# Altium schematic sheet 06 - Soft_DPHY.SchDoc: Soft DPHY
size A3; Date:: 0; Page Number: 6; Page Size: B; Page Count: 12; Board Rev: B; Project Name: CrossLink-NX Evaluation Board; RevCode: 1.0; Doc: 305-PD-19-0819; DsnPath: C:\Users\HAltinkilit\Downloads\Crosslink-NX-Design-Files\CrossLink-NX-Eval-Brd-Schematic-RevB-191122.DSN; SchematicName: SCHEMATIC1; PageName: 10 - FMC-LPC; PageSize: B; TopSchematic: True
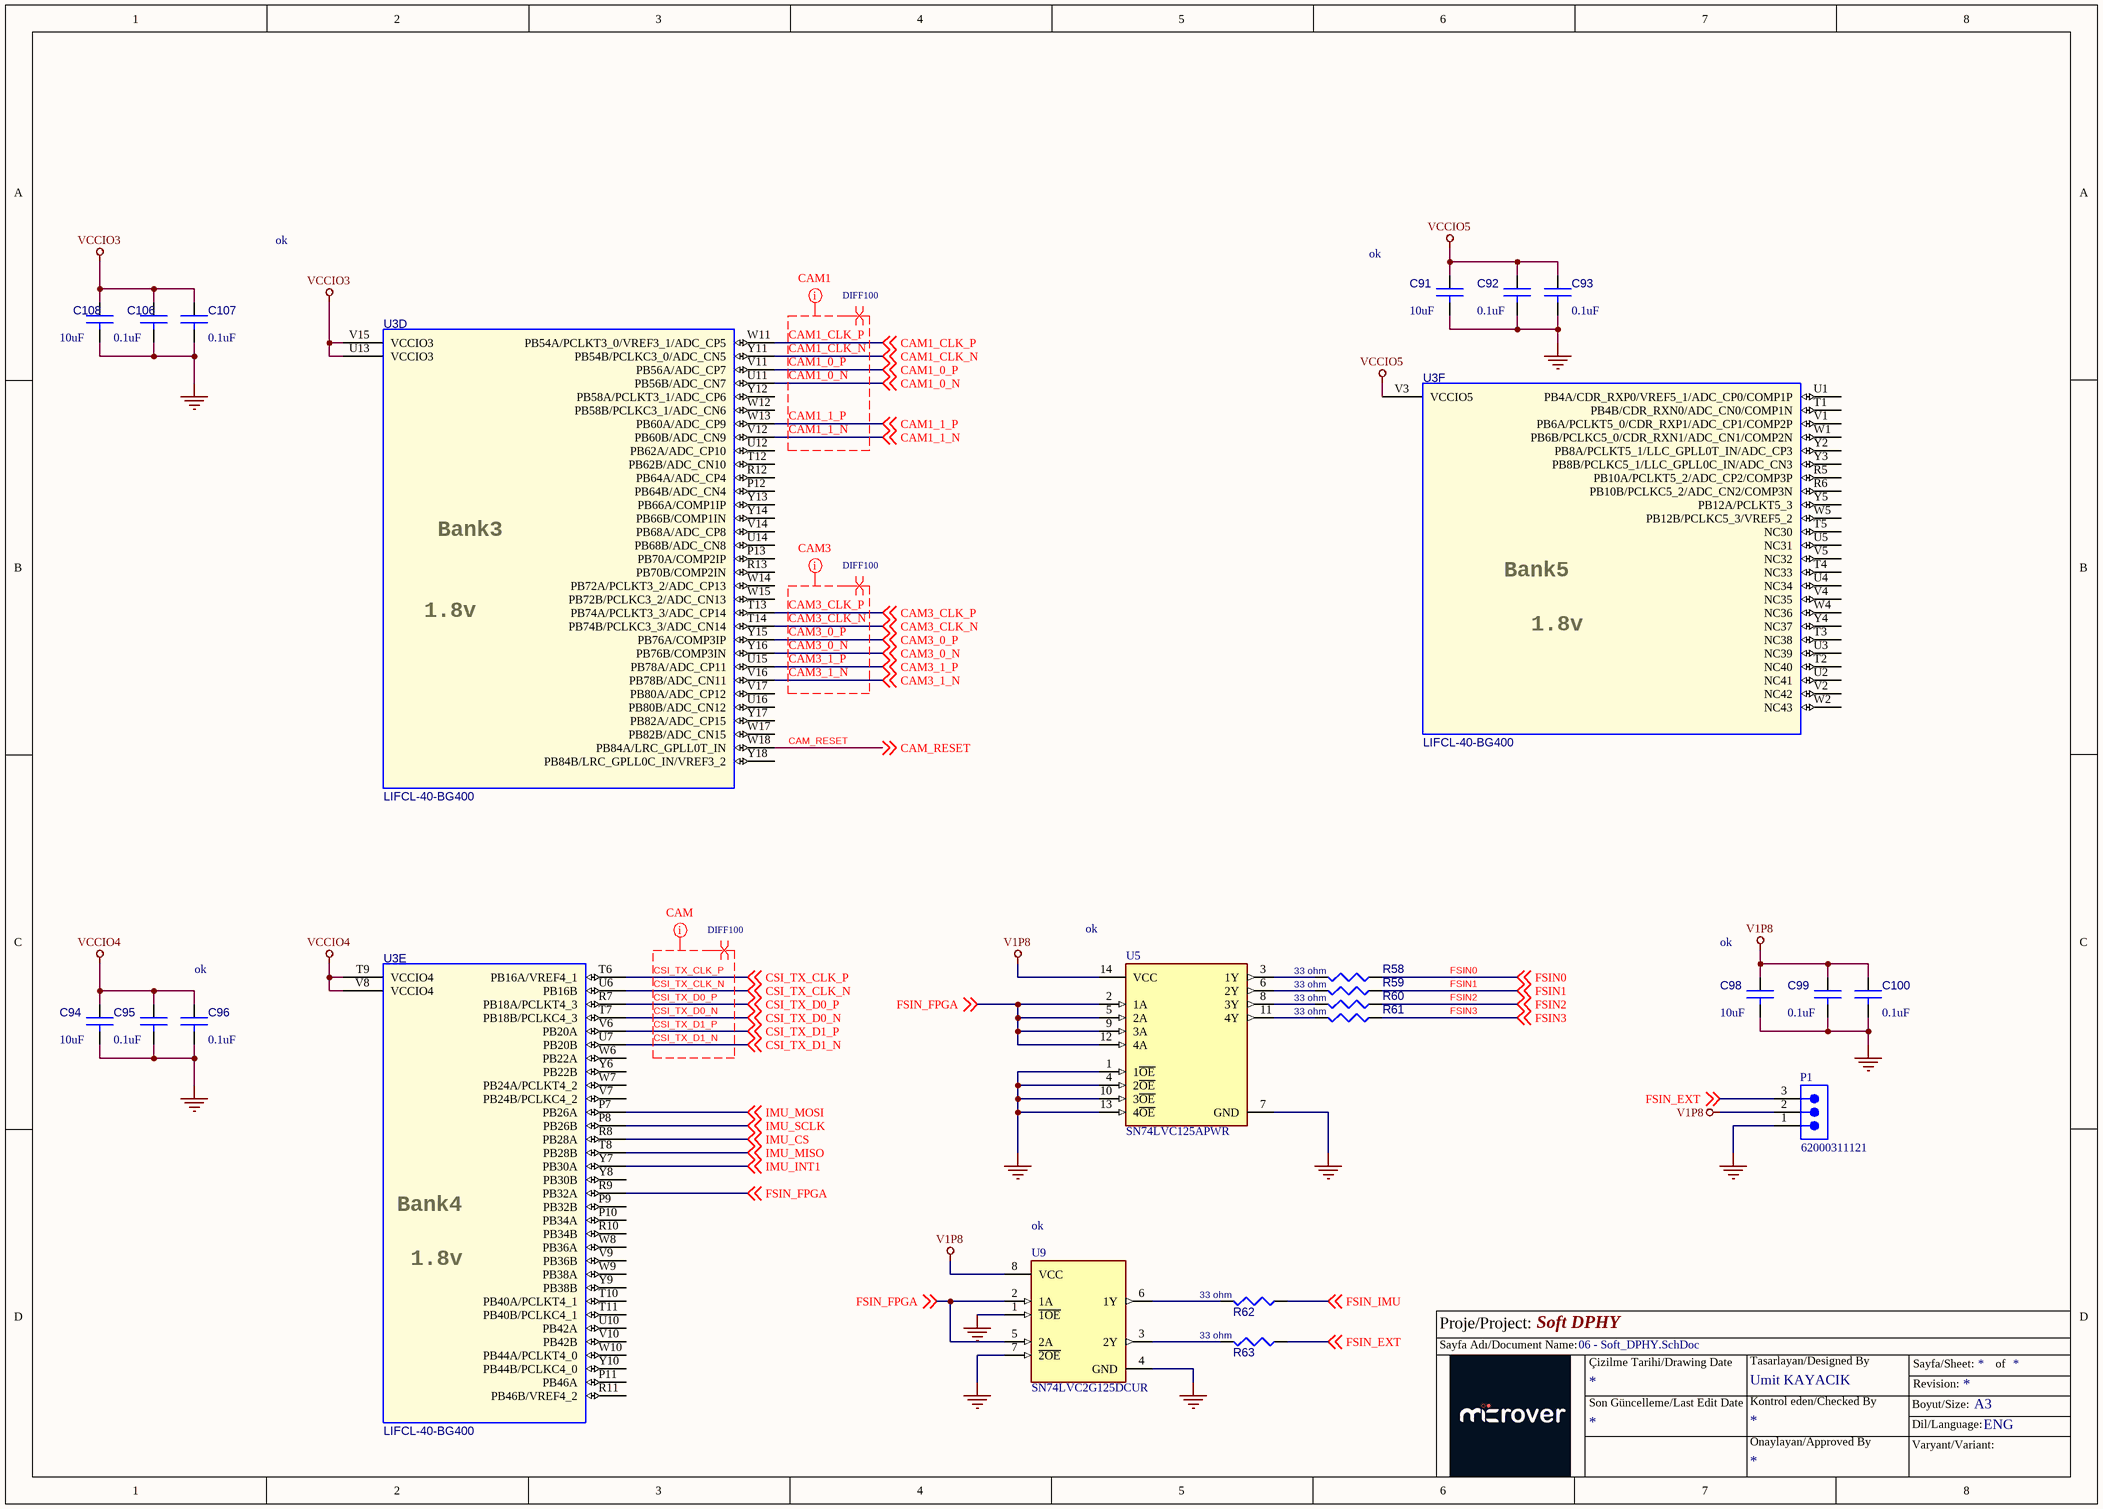
[diagram p0: 06 - Soft_DPHY.SchDoc]

## Parts
C91  10uF  [C0603]
C92  0.1uF  [C0201]
C93  0.1uF  [C0201]
C94  10uF  [C0603]
C95  0.1uF  [C0201]
C96  0.1uF  [C0201]
C98  10uF  [C0603]
C99  0.1uF  [C0201]
C100  0.1uF  [C0201]
C106  0.1uF  [C0201]
C107  0.1uF  [C0201]
C108  10uF  [C0603]
P1  62000311121  [62000311121]
R58  33 ohm  [R0402]
R59  33 ohm  [R0402]
R60  33 ohm  [R0402]
R61  33 ohm  [R0402]
R62  33 ohm  [RLP-100]
R63  33 ohm  [R0402]
U3  LIFCL-40-BG400  [LIFCL-40-BG400]  (parts D,E,F of 15)
U5  SN74LVC125APWR  [FP-PW0014A-IPC_B]
U9  SN74LVC2G125DCUR  [FP-DCU0008A-MFG]

## Nets
GND: C91.2 C92.2 C93.2 C94.2 C95.2 C96.2 C98.2 C99.2 C100.2 C106.2 C107.2 C108.2 P1.1 U5.1(1~{OE}) U5.4(2~{OE}) U5.7(GND) U5.10(3~{OE}) U5.13(4~{OE}) U9.1(~{1OE}) U9.4(GND) U9.7(~{2OE})
V1P8: C98.1 C99.1 C100.1 P1.2 U5.14(VCC) U9.8(VCC)
VCCIO3: C106.1 C107.1 C108.1 U3.U13(VCCIO3) U3.V15(VCCIO3)
VCCIO4: C94.1 C95.1 C96.1 U3.T9(VCCIO4) U3.V8(VCCIO4)
VCCIO5: C91.1 C92.1 C93.1 U3.V3(VCCIO5)
CAM1_0_N: U3.U11(PB56B/ADC_CN7) ; off-sheet CAM1_0_N
CAM1_0_P: U3.V11(PB56A/ADC_CP7) ; off-sheet CAM1_0_P
CAM1_1_N: U3.V12(PB60B/ADC_CN9) ; off-sheet CAM1_1_N
CAM1_1_P: U3.W13(PB60A/ADC_CP9) ; off-sheet CAM1_1_P
CAM1_CLK_N: U3.Y11(PB54B/PCLKC3_0/ADC_CN5) ; off-sheet CAM1_CLK_N
CAM1_CLK_P: U3.W11(PB54A/PCLKT3_0/VREF3_1/ADC_CP5) ; off-sheet CAM1_CLK_P
CAM3_0_N: U3.Y16(PB76B/COMP3IN) ; off-sheet CAM3_0_N
CAM3_0_P: U3.Y15(PB76A/COMP3IP) ; off-sheet CAM3_0_P
CAM3_1_N: U3.V16(PB78B/ADC_CN11) ; off-sheet CAM3_1_N
CAM3_1_P: U3.U15(PB78A/ADC_CP11) ; off-sheet CAM3_1_P
CAM3_CLK_N: U3.T14(PB74B/PCLKC3_3/ADC_CN14) ; off-sheet CAM3_CLK_N
CAM3_CLK_P: U3.T13(PB74A/PCLKT3_3/ADC_CP14) ; off-sheet CAM3_CLK_P
CAM_RESET: U3.W18(PB84A/LRC_GPLL0T_IN) ; off-sheet CAM_RESET
CSI_TX_CLK_N: U3.U6(PB16B) ; off-sheet CSI_TX_CLK_N
CSI_TX_CLK_P: U3.T6(PB16A/VREF4_1) ; off-sheet CSI_TX_CLK_P
CSI_TX_D0_N: U3.T7(PB18B/PCLKC4_3) ; off-sheet CSI_TX_D0_N
CSI_TX_D0_P: U3.R7(PB18A/PCLKT4_3) ; off-sheet CSI_TX_D0_P
CSI_TX_D1_N: U3.U7(PB20B) ; off-sheet CSI_TX_D1_N
CSI_TX_D1_P: U3.V6(PB20A) ; off-sheet CSI_TX_D1_P
FSIN0: R58.2 ; off-sheet FSIN0
FSIN1: R59.2 ; off-sheet FSIN1
FSIN2: R60.2 ; off-sheet FSIN2
FSIN3: R61.2 ; off-sheet FSIN3
FSIN_EXT: P1.3 R63.2 ; off-sheet FSIN_EXT
FSIN_FPGA: U3.R9(PB32A) U5.2(1A) U5.5(2A) U5.9(3A) U5.12(4A) U9.2(1A) U9.5(2A) ; off-sheet FSIN_FPGA
FSIN_IMU: R62.2 ; off-sheet FSIN_IMU
IMU_CS: U3.R8(PB28A) ; off-sheet IMU_CS
IMU_INT1: U3.Y7(PB30A) ; off-sheet IMU_INT1
IMU_MISO: U3.T8(PB28B) ; off-sheet IMU_MISO
IMU_MOSI: U3.P7(PB26A) ; off-sheet IMU_MOSI
IMU_SCLK: U3.P8(PB26B) ; off-sheet IMU_SCLK
NetR58_1: R58.1 U5.3(1Y)
NetR59_1: R59.1 U5.6(2Y)
NetR60_1: R60.1 U5.8(3Y)
NetR61_1: R61.1 U5.11(4Y)
NetR62_1: R62.1 U9.6(1Y)
NetR63_1: R63.1 U9.3(2Y)

Not connected (* = marked no-connect by the designer): U3 P9(PB32B) P10(PB34A) P11(PB46A) P12(PB64B/ADC_CN4) P13(PB70A/COMP2IP) R5(PB10A/PCLKT5_2/ADC_CP2/COMP3P) R6(PB10B/PCLKC5_2/ADC_CN2/COMP3N) R10(PB34B) R11(PB46B/VREF4_2) R12(PB64A/ADC_CP4) R13(PB70B/COMP2IN) T1(PB4B/CDR_RXN0/ADC_CN0/COMP1N) T2(NC40) T3(NC38) T4(NC33) T5(NC30) T10(PB40A/PCLKT4_1) T11(PB40B/PCLKC4_1) T12(PB62B/ADC_CN10) U1(PB4A/CDR_RXP0/VREF5_1/ADC_CP0/COMP1P) U2(NC41) U3(NC39) U4(NC34) U5(NC31) U10(PB42A) U12(PB62A/ADC_CP10) U14(PB68B/ADC_CN8) U16(PB80B/ADC_CN12) V1(PB6A/PCLKT5_0/CDR_RXP1/ADC_CP1/COMP2P) V2(NC42) V4(NC35) V5(NC32) V7(PB24B/PCLKC4_2) V9(PB36B) V10(PB42B) V14(PB68A/ADC_CP8) V17(PB80A/ADC_CP12) W1(PB6B/PCLKC5_0/CDR_RXN1/ADC_CN1/COMP2N) W2(NC43) W4(NC36) W5(PB12B/PCLKC5_3/VREF5_2) W6(PB22A) W7(PB24A/PCLKT4_2) W8(PB36A) W9(PB38A) W10(PB44A/PCLKT4_0) W12(PB58B/PCLKC3_1/ADC_CN6) W14(PB72A/PCLKT3_2/ADC_CP13) W15(PB72B/PCLKC3_2/ADC_CN13) W17(PB82B/ADC_CN15) Y2(PB8A/PCLKT5_1/LLC_GPLL0T_IN/ADC_CP3) Y3(PB8B/PCLKC5_1/LLC_GPLL0C_IN/ADC_CN3) Y4(NC37) Y5(PB12A/PCLKT5_3) Y6(PB22B) Y8(PB30B) Y9(PB38B) Y10(PB44B/PCLKC4_0) Y12(PB58A/PCLKT3_1/ADC_CP6) Y13(PB66A/COMP1IP) Y14(PB66B/COMP1IN) Y17(PB82A/ADC_CP15) Y18(PB84B/LRC_GPLL0C_IN/VREF3_2)

## Layout directives
net class CAM3: CAM3_0_N, CAM3_0_P, CAM3_1_N, CAM3_1_P, CAM3_CLK_N, CAM3_CLK_P
differential pair; differential pair class DIFF100: CAM1_0_N, CAM1_0_P, CAM1_1_N, CAM1_1_P, CAM1_CLK_N, CAM1_CLK_P, CAM3_0_N, CAM3_0_P, CAM3_1_N, CAM3_1_P, CAM3_CLK_N, CAM3_CLK_P, CSI_TX_CLK_N, CSI_TX_CLK_P, CSI_TX_D0_N, CSI_TX_D0_P, CSI_TX_D1_N, CSI_TX_D1_P
net class CAM1: CAM1_0_N, CAM1_0_P, CAM1_1_N, CAM1_1_P, CAM1_CLK_N, CAM1_CLK_P
net class CAM: CSI_TX_CLK_N, CSI_TX_CLK_P, CSI_TX_D0_N, CSI_TX_D0_P, CSI_TX_D1_N, CSI_TX_D1_P

## Notes on the sheet
- ok
- (near U3) Bank3
- (near U3) Bank5
- (near U3) 1.8v
- (near U5) ok
- (near C98) ok
- (near U3) Bank4
- (near U9) ok
- Proje/Project:
- Sayfa Adı/Document Name:
- Çizilme Tarihi/Drawing Date
- Umit KAYACIK
- Tasarlayan/Designed By
- Sayfa/Sheet:
- Revision:
- of
- Son Güncelleme/Last Edit Date
- Kontrol eden/Checked By
- Onaylayan/Approved By
- Boyut/Size:
- Varyant/Variant:
- Dil/Language:
- A3
- ENG

## Library data of the parts
C91 C98 = 10uF_0603: CAP CECAP CER 10UF 10V X5R 20% 0603; Manufacturer: Taiyo Yuden; Manufacturer Part Number: LMK107BJ106MALTD; Part Reference: C91; Class: Discrete; Digikey P/N: 587-2562-1-ND; Assy: -; Value: 10uF; PCB Footprint: C0603
C92 C99 = 0u1_0402: CAP CER 0.1UF 25V 10% X5R 0201; Manufacturer: Murata; Manufacturer Part Number: GRM033R61E104KE14J; Part Reference: C92; Class: Discrete; Digikey P/N: 399-3521-2-ND; Assy: -; Value: 0.1uF; PCB Footprint: C0201
C93 C100 = 0u1_0402: CAP CER 0.1UF 25V 10% X5R 0201; Manufacturer: Murata; Manufacturer Part Number: GRM033R61E104KE14J; Part Reference: C93; Class: Discrete; Digikey P/N: 399-3521-2-ND; Assy: -; Value: 0.1uF; PCB Footprint: C0201
C94 = 10uF_0603: CAP CECAP CER 10UF 10V X5R 20% 0603; Manufacturer: Taiyo Yuden; Manufacturer Part Number: LMK107BJ106MALTD; Part Reference: C94; Class: Discrete; Digikey P/N: 587-2562-1-ND; Assy: -; Value: 10uF; PCB Footprint: C0603
C95 = 0u1_0402: CAP CER 0.1UF 25V 10% X5R 0201; Manufacturer: Murata; Manufacturer Part Number: GRM033R61E104KE14J; Part Reference: C95; Class: Discrete; Digikey P/N: 399-3521-2-ND; Assy: -; Value: 0.1uF; PCB Footprint: C0201
C96 = 0u1_0402: CAP CER 0.1UF 25V 10% X5R 0201; Manufacturer: Murata; Manufacturer Part Number: GRM033R61E104KE14J; Part Reference: C96; Class: Discrete; Digikey P/N: 399-3521-2-ND; Assy: -; Value: 0.1uF; PCB Footprint: C0201
C106 = 0u1_0402: CAP CER 0.1UF 25V 10% X5R 0201; Manufacturer: Murata; Manufacturer Part Number: GRM033R61E104KE14J; Part Reference: C106; Class: Discrete; Digikey P/N: 399-3521-2-ND; Assy: -; Value: 0.1uF; PCB Footprint: C0201
C107 = 0u1_0402: CAP CER 0.1UF 25V 10% X5R 0201; Manufacturer: Murata; Manufacturer Part Number: GRM033R61E104KE14J; Part Reference: C107; Class: Discrete; Digikey P/N: 399-3521-2-ND; Assy: -; Value: 0.1uF; PCB Footprint: C0201
C108 = 10uF_0603: CAP CECAP CER 10UF 10V X5R 20% 0603; Manufacturer: Taiyo Yuden; Manufacturer Part Number: LMK107BJ106MALTD; Part Reference: C108; Class: Discrete; Digikey P/N: 587-2562-1-ND; Assy: -; Value: 10uF; PCB Footprint: C0603
P1 = CMP-1502-00957-5: THT Vertical Pin Header WR-PHD, Pitch 2.00 mm, Single Row, 3 pins; Voltage Rating: 200V; Current Rating: 2A; Gender: Male; Contact Resistance: 20mΩ; Number of Contacts: 3; Min Operating Temperature: -40°C; Max Operating Temperature: 105°C; Height: 6.35mm; Operating Supply Voltage: 200V; Number of Rows: 1; RoHS: Compliant; Number of Pins: 3; Contact Material: Gold; Lead Pitch: 2mm; Orientation: Vertical
R58-R63 = RES_100K_1W16_0402_5P: RES SMD 33 OHM 1% 1/20W 0201; Part Reference: R27; Unit Price (USD): 0.02; Total Area(sq-mm): 0.5; Wattage: 1/16W; DIST: FLAT; MAX_TEMP: RTMAX; MFG: Yageo; TC1: 0; Assy: DNI; PCB Footprint: R0201; Length(mm): 1; Width(mm): 0.5; TC2: 0; Value: 33 ohm; Manufacturer: Yageo
U3 = LIFCL-40-BG400: Part Reference: U3; Source Part: LIFCL-40-BG400A.Normal; SWAP_INFO: (S1+S2+S3+S4+S5+S6+S7+S8+S9+S10+S11+S12+S13+S14+S15); SPLIT_INST: TRUE; Name: I17266603; Primitive: DEFAULT; Implementation Type: <none>; Location X-Coordinate: 0; Source Library: C:\USERS\SLIU1\DOCUMENTS\PCB_DESIGN\JEDI_EVAL_BOARD\SCHEMATIC\LIFCL40.OLB; Power Pins Visible: False; Value: LIFCL-40-BG400; Assy: -; Location Y-Coordinate: 0; Color: Default; Source Package: LIFCL-40-BG400; Graphic: LIFCL-40-BG400A.Normal; PCB Footprint: LIFCL-40-BG400
U5 = CMP-0440-00179-4: IC BUF NON-INVERT 3.6V 14TSSOP; Max Power Dissipation: 500mW; Number of Bits per Element: 1; Number of Bits: 4; Quiescent Current: 1uA; Min Supply Voltage: 1.65V; Propagation Delay: 4.6ns; High Level Output Current: -24mA; Logic Function: Buffer; Low Level Output Current: 24mA; Polarity: Non-Inverting; Turn-On Delay Time: 5.3ns; Number of Output Lines: 3; Mount: Surface Mount; Lead Free: Lead Free; Number of Outputs: 4; Max Supply Voltage: 3.6V; Packaging: Tape and Reel; Radiation Hardening: No; Number of Channels: 4; REACH SVHC: No SVHC; Length: 5mm; Number of Elements: 4; Contact Plating: Gold; Case/Package: TSSOP; Number of Input Lines: 4; Number of Inputs: 4; Height: 1.15mm; Number of Circuits: 4; Termination: SMD/SMT; Min Operating Temperature: -40°C; Package Quantity: 1; Number of Gates: 4; Max Operating Temperature: 125°C; Width: 4.4mm; Number of Pins: 14
U9 = CMP-0859-00680-4: IC BUFFER NON-INVERT 5.5V US8; Manufacturer: Texas Instruments; Propagation Delay: 4.2ns; Number Of Outputs: 1; Logic Function Desc: Non-Inverting; Max Junction Temp: +150°C; Number Of Circuits: 2; Min Supply Voltage: 1.65V; Standoff Height: 0mm; Mouser Description: Buffers & Line Drivers Tri-State Dual Bus; Package: DCU0008A; Digikey Description: IC BUFFER NON-INVERT 5.5V US8; Height: 0.9mm; Device Class L3: Buffers; ComponentLink2URL: http://www.ti.com/lit/ds/symlink/sn74lvc2g125.pdf; Temperature Range Low: -40°C; Automotive: No; Max Supply Voltage: 5.5V; Temperature: -40°C to +125°C; ComponentLink2Description: Datasheet; Device Class L2: Logic ICs; Lead Free: Yes; Ipc Land Pattern Name: SOP50P310X75-8; Octopart: https://octopart.com/sn74lvc2g125dcur-texas+instruments-464564; Category: IC; Number Of Inputs: 1; Ambient Temperature Range Low: -40°C; RoHS: TRUE; Temperature Range High: +125°C; Device Class L1: Integrated Circuits (ICs); Manufacturer Part Number: SN74LVC2G125DCUR; Ambient Temperature Range High: +125°C